# EAGLE design js_simple (EAGLE 9.5.2)
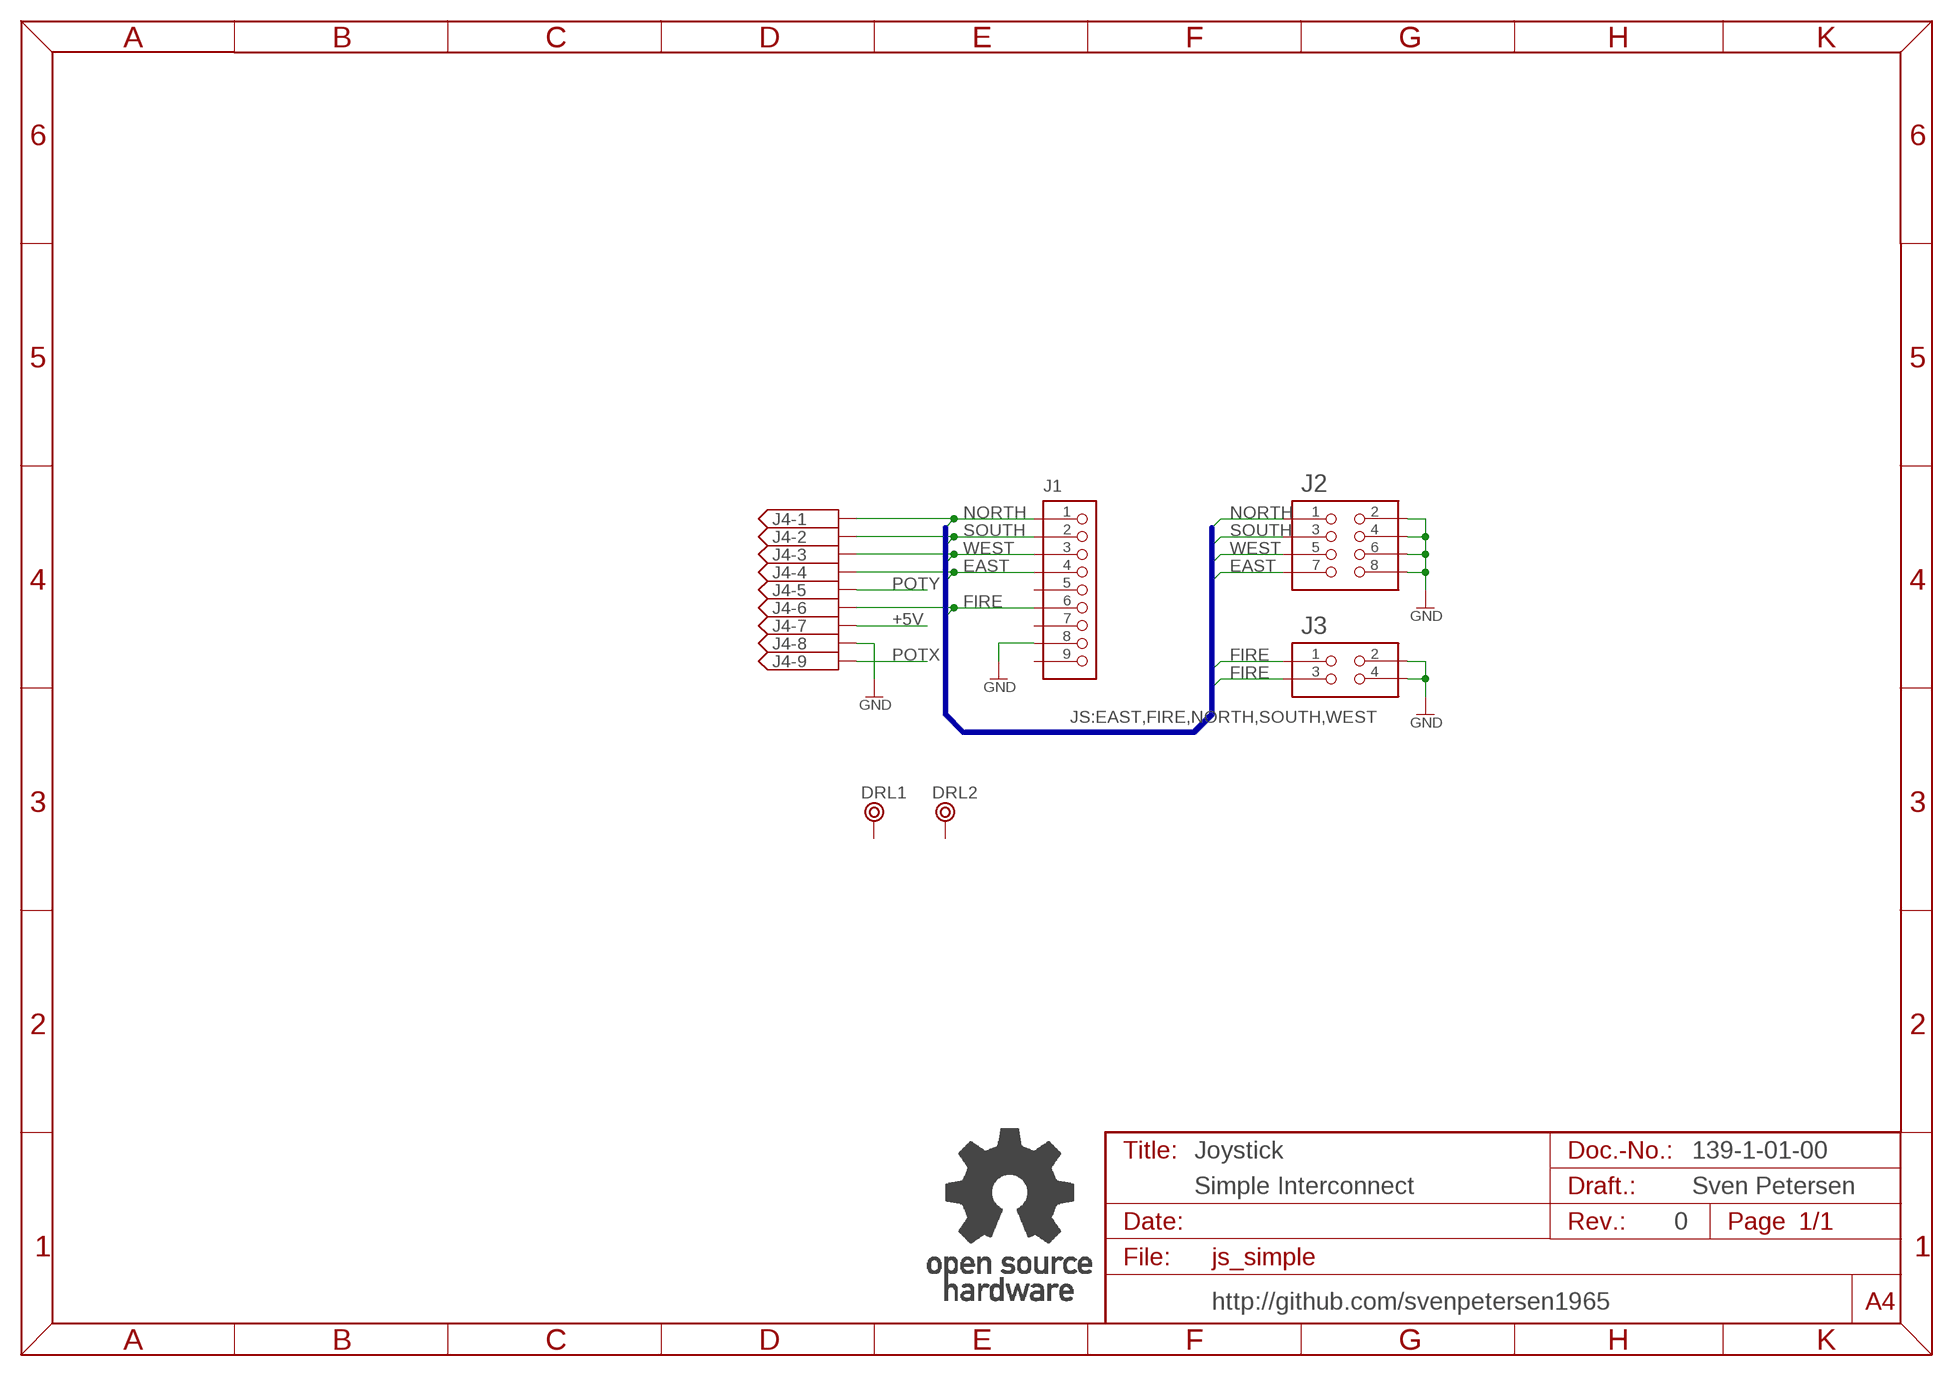
[diagram p0: schematic, sheet 1]

## Parts
DRL1  BOHR3,5  [BOHR3,5]
DRL2  BOHR3,5  [BOHR3,5]
J1  PINHD-1X9  [1X09]
J2  PINHD-2X4  [2X04]
J3  PINHD-2X2  [2X02]
J4  9X1X2SMD  [9PIN_1X2SMD]
U$8  OPEN_SOURCE_HW  [OPENHW]

## Nets
+5V: J4.7
EAST: J1.4 J2.7 J4.4
FIRE: J1.6 J3.1 J3.3 J4.6
GND: J1.8 J2.2 J2.4 J2.6 J2.8 J3.2 J3.4 J4.8
NORTH: J1.1 J2.1 J4.1
POTX: J4.9
POTY: J4.5
SOUTH: J1.2 J2.3 J4.2
WEST: J1.3 J2.5 J4.3
Unconnected: DRL1.P$1 DRL2.P$1 J1.5 J1.7 J1.9

## Buses
JS:EAST,FIRE,NORTH,SOUTH,WEST

## Notes on the sheet
- Joystick | 139-1-01-00
- Simple Interconnect | Sven Petersen
- 0
- http://github.com/svenpetersen1965

## Library data of the parts
DRL1 DRL2 = Mech_Bohr:BOHR3,5
J1 = PINHEAD:PINHD-1X9
J2 = PINHEAD:PINHD-2X4
J3 = PINHEAD:PINHD-2X2
J4 = Pads:9X1X2SMD
U$8 = Logo:OPEN_SOURCE_HW

## Board
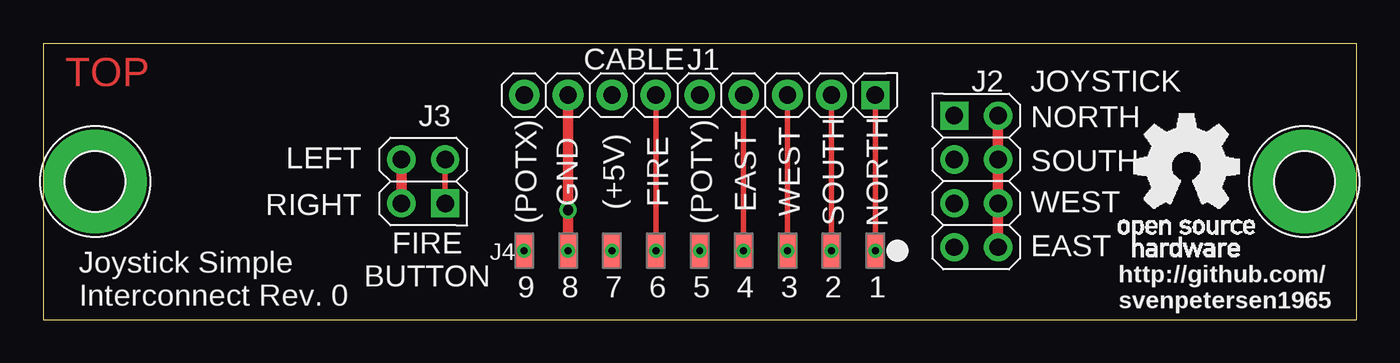
[diagram p1: board, top side]
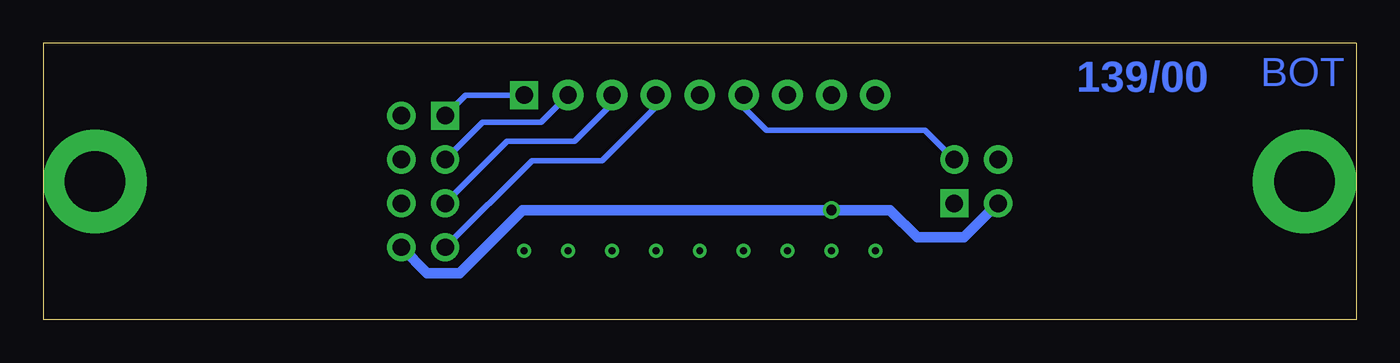
[diagram p2: board, bottom side, seen from below]

Size 76 x 16 mm. Coordinates in mm from the lower left corner, seen from the top.
Outline: 0,0 76,0 76,16 0,16 0,0
Copper layers (1*16): Top 0.035mm / dielectric 1.5mm / Bottom 0.035mm
Design rules "default": minimum track width 6mil, minimum drill 0.35mm, track to track 6mil, track to pad 6mil, pad to pad 6mil, via to via 6mil, smd to smd 6mil, copper to edge 40mil, drill to drill 6mil, minimum pad ring 10mil, minimum via ring 8mil, stop-mask expansion 4mil, vias tented up to drill 0mil, thermal gap 10mil

### Footprints (pad centres in the part's own frame; a part is rotated, then mirrored left to right if it is on the bottom)
BOHR3,5 = drill 3.5 pad 6: P$1 0,0
1X09 = drill 1 pad 1.626 square: 1 -10.16,0 | drill 1 pad 1.778: 2 -7.62,0; 3 -5.08,0; 4 -2.54,0; 5 0,0; 6 2.54,0; 7 5.08,0; 8 7.62,0; 9 10.16,0
2X04 = drill 1 pad 1.626 square: 1 -3.81,-1.27 | drill 1 pad 1.626: 2 -3.81,1.27; 3 -1.27,-1.27; 4 -1.27,1.27; 5 1.27,-1.27; 6 1.27,1.27; 7 3.81,-1.27; 8 3.81,1.27
2X02 = drill 1 pad 1.626 square: 1 -1.27,-1.27 | drill 1 pad 1.626: 2 -1.27,1.27; 3 1.27,-1.27; 4 1.27,1.27
9PIN_1X2SMD = smd 2 x 1: 1 0,10.16; 2 0,7.62; 3 0,5.08; 4 0,2.54; 5 0,0; 6 0,-2.54; 7 0,-5.08; 8 0,-7.62; 9 0,-10.16

### Placement (x,y rotation side)
DRL1  3,8 0 top
DRL2  73,8 0 top
J1  38,13 180 top
J2  54,8 270 top
J3  22,8 90 top
J4  38,4 270 top
U$6  [PCB-TITLE/]  0,27.46 0 top  (outside the outline)
U$7  [2LAYER]  1.27,13.49 0 top
U$8  62.23,3.65 0 top

### Tracks (layer width: path | path; a pad name or v marks a point on that pad's centre or on a via)
+5V  (via drill 0.4)
  other vias: 32.92,4
EAST  (via drill 0.4)
  Top 0.305: J4.4 40.54,6.03 J1.4
  Bottom 0.305: J2.7 47.71,9.21 43.66,9.21 40.54,12.32 J1.4
  other vias: 40.54,4
FIRE  (via drill 0.4)
  Top 0.305: J4.6 35.46,10.16 J1.6 | J3.1 J3.3
  Bottom 0.305: J1.6 35.46,12.28 34.13,10.95 24.95,10.95 J3.3
  other vias: 35.46,4
GND  (via drill 0.4, 0.6)
  Top 0.61: J4.8 30.38,5.71 v30.38,6.35 J1.8 | J3.2 J3.4 | J2.8 J2.6 J2.4 J2.2
  Bottom 0.61: J3.2 22.7,4.76 25.4,4.76 26.99,6.35 v30.38,6.35 48.26,6.35 51.91,2.7 53.78,2.7 J2.8
  other vias: 30.38,4
NORTH  (via drill 0.4)
  Top 0.305: J4.1 J1.1
  Bottom 0.305: J1.1 51.54,13 J2.1
  other vias: 48.16,4
POTX  (via drill 0.4)
  other vias: 27.84,4
POTY  (via drill 0.4)
  other vias: 38,4
SOUTH  (via drill 0.4)
  Top 0.305: J4.2 45.62,9.37 J1.2
  Bottom 0.305: 52.63,9.37 J2.3 50.57,11.43 47.19,11.43 J1.2
  other vias: 45.62,4
WEST  (via drill 0.4)
  Top 0.305: J4.3 43.08,7.14 J1.3
  Bottom 0.305: J2.5 49.14,10.32 45.24,10.32 43.02,12.54 43.02,12.94 J1.3
  other vias: 43.08,4

### Text on the board
Bottom: 139/00
tPlace: CABLE | JOYSTICK | NORTH | LEFT | (POTX) | GND | (+5V) | FIRE | (POTY) | EAST | WEST | SOUTH | NORTH | SOUTH | RIGHT | WEST | EAST | FIRE / BUTTON | Joystick Simple / Interconnect Rev. 0 | 9 | 8 | 7 | 6 | 5 | 4 | 3 | 2 | 1 | http://github.com/ / svenpetersen1965
Measures: 2-3.5
Document: 139-2-01-00 | Sven Petersen / 2019 | 35µm | 2 | 0